# Altium project eInkDisplay.PrjPcb
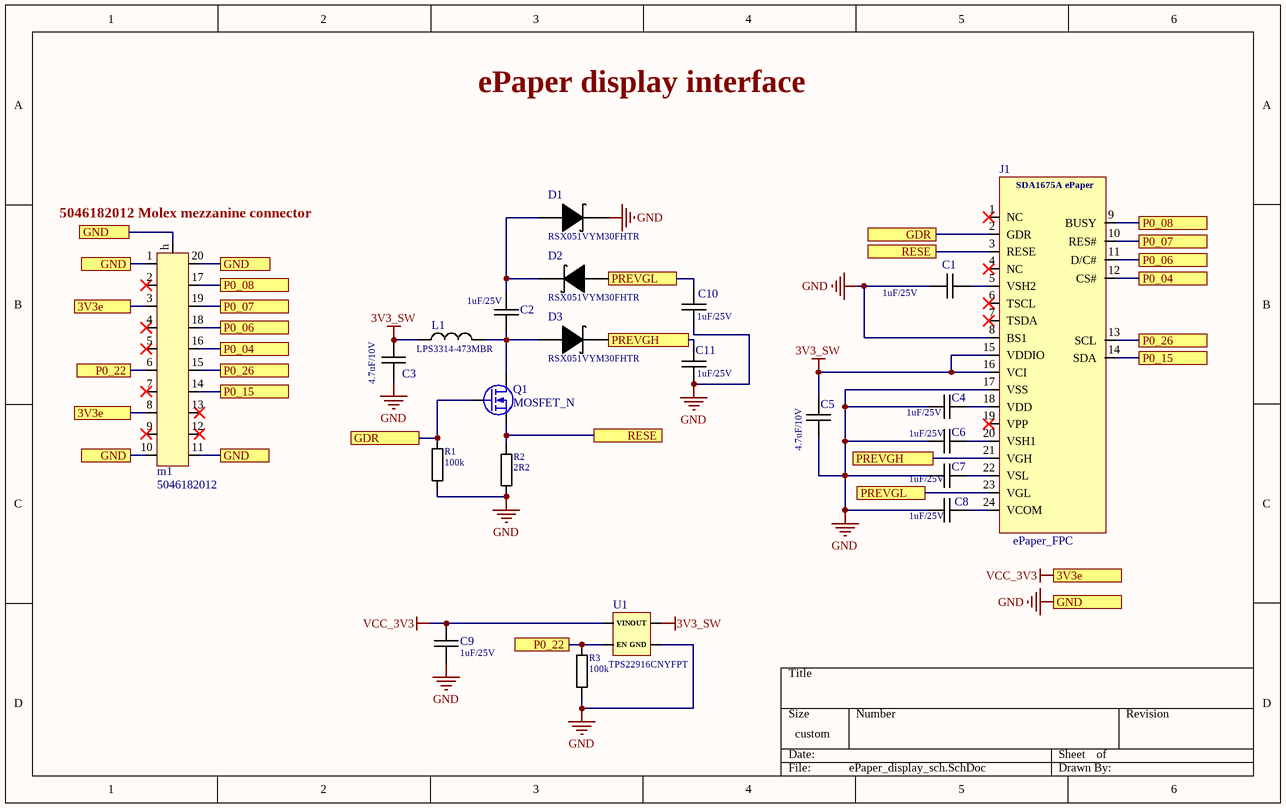
[diagram p0: ePaper_display_sch.SchDoc]
1 sheet, 22 parts. Net scope: flat (ports and power ports of the same name join across sheets).
Board file: ePaper_display_pcb.PcbDoc

## Sheet ePaper_display_sch.SchDoc
size 240 x 149 mm

### Parts
C1  1uF/25V  [0402C]
C2  1uF/25V  [0402C]
C3  4.7uF/10V  [0603C]
C4  1uF/25V  [0402C]
C5  4.7uF/10V  [0603C]
C6  1uF/25V  [0402C]
C7  1uF/25V  [0402C]
C8  1uF/25V  [0402C]
C9  1uF/25V  [0402C]
C10  1uF/25V  [0402C]
C11  1uF/25V  [0402C]
D1  RSX051VYM30FHTR  [TUMD2M]
D2  RSX051VYM30FHTR  [TUMD2M]
D3  RSX051VYM30FHTR  [TUMD2M]
J1  ePaper_FPC  [SSD1675A_ZIF_24pins]
L1  LPS3314-473MBR  [IND_WURTH_WE-TPC_4828]
m1  5046182012  [5046182012_molex_mezz]
Q1  MOSFET_N  [SC-70_3_leads]
R1  100k  [0201R]
R2  2R2  [0603R]
R3  100k  [0201R]
U1  TPS22916CNYFPT  [BGA_4pin_0.8x0.8]

### Ports
3V3e, GDR, GND, P0_04, P0_06, P0_07, P0_08, P0_15, P0_22, P0_26, PREVGH, PREVGL, RESE

### Nets
3V3_SW: C3.2 C5.2 J1.15(VDDIO) J1.16(VCI) L1.1 U1.A1(OUT)
GND: C1.1 C3.1 C4.1 C5.1 C6.1 C7.1 C8.1 C9.2 C10.1 C11.1 D1.2(K) J1.8(BS1) J1.17(VSS) m1.1 m1.10 m1.11 m1.20 m1.h R1.2 R2.2 R3.2 U1.B1(GND) ; port GND
VCC_3V3: C9.1 m1.3 m1.8 U1.A2(VIN) ; port 3V3e
NetC1_2: C1.2 J1.5(VSH2)
NetC2_1: C2.1 D3.1(A) L1.2 Q1.D
NetC2_2: C2.2 D1.1(A) D2.2(K)
NetC4_2: C4.2 J1.18(VDD)
NetC6_2: C6.2 J1.20(VSH1)
NetC7_2: C7.2 J1.22(VSL)
NetC8_2: C8.2 J1.24(VCOM)
NetC10_2: C10.2 D2.1(A) J1.23(VGL) ; port PREVGL
NetC11_2: C11.2 D3.2(K) J1.21(VGH) ; port PREVGH
NetJ1_2: J1.2(GDR) Q1.G R1.1 ; port GDR
NetJ1_3: J1.3(RESE) Q1.S R2.1 ; port RESE
NetJ1_9: J1.9(BUSY) m1.17 ; port P0_08
NetJ1_10: J1.10(RES#) m1.19 ; port P0_07
NetJ1_11: J1.11(D/C#) m1.18 ; port P0_06
NetJ1_12: J1.12(CS#) m1.16 ; port P0_04
NetJ1_13: J1.13(SCL) m1.15 ; port P0_26
NetJ1_14: J1.14(SDA) m1.14 ; port P0_15
Netm1_6: m1.6 R3.1 U1.B2(EN) ; port P0_22

Not connected (* = marked no-connect by the designer): J1 1(NC)* 4(NC)* 6(TSCL)* 7(TSDA)* 19(VPP)*; m1 2* 4* 5* 7* 9* 12* 13*

### Notes on the sheet
- ePaper display interface
- (near m1) 5046182012 Molex mezzanine connector
- (in symbol SSD1675A_ePaper) SDA1675A ePaper

### Library data of the parts
C1 C2 C4 C6-C11 = 0603C-GENERIC: CAPACITOR 0603 CERAMIC GENERIC; Manufacturer: MURATA; Manufacturer part number: GRM155R61E105KA12D; Supplier Part Number: 2218855; Supplier: Farnell
C3 C5 = 0805C-TBD: CAPACITOR 0603 CERAMIC; Manufacturer part number: C1608X5R1E475K080AC; Manufacturer: TDK; Supplier Part Number: 2525101; Supplier: Farnell
D1-D3 = Shotkey_diode: pin to pad: 1>A 2>K; Manufacturer: ROHM; Manufacturer Part Number: RSX051VYM30FHTR; Supplier Part Number: 2581630; Supplier: Farnell
J1 = SSD1675A_ePaper: Manufacturer: Omron Electronics; Manufacturer part number: XF3M-2415-1B; Supplier Part Number: 653-XF3M-2415-1B; Supplier: Mouser
L1 = INDUCTOR: Manufacturer Part Number: LPS3314-473MRB; Manufacturer: Coilcraft; Supplier Part Number: 994-LPS3314-473MRB; Supplier: Mouser
m1 = 5046182012_molex_mezz: Manufacturer: Molex; Manufacturer Part Number: 5046182012; Supplier Part Number: 538-504618-2012; Supplier: Mouser
Q1 = MOSFET_N: Manufacturer Part Number: SI1308EDL-T1-BE3; Manufacturer: Vishay / Siliconix; Supplier Part Number: 78-SI1308EDL-T1-BE3; Supplier: Mouser
R1 R3 = Resistor: Manufacturer Part Number: *; Manufacturer: *; Supplier Part Number: *; Supplier: *
R2 = Resistor: Manufacturer Part Number: ERJP03J2R2V; Manufacturer: PANASONIC; Supplier Part Number: 1750637; Supplier: Farnell
U1 = TPS22916_Lsw: Manufacturer: TI; Manufacturer Part Number: TPS22916CNYFPT; Supplier Part Number: 595-TPS22916CNYFPT; Supplier: Mouser